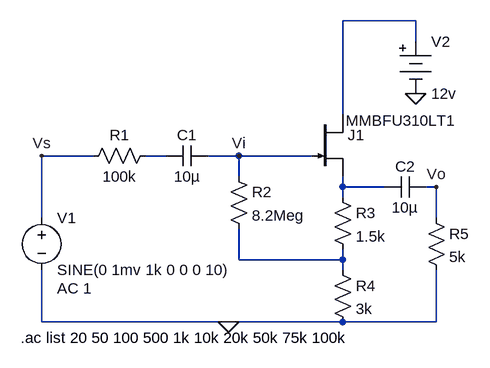
[diagram p0: schematic BootstrapV2.asc]
BootstrapV2.asc, the LTspice schematic file:
Version 4
SHEET 1 952 680
WIRE 512 -48 400 -48
WIRE 512 -16 512 -48
WIRE 400 96 400 -48
WIRE 16 160 -64 160
WIRE 128 160 96 160
WIRE 240 160 192 160
WIRE 352 160 240 160
WIRE 240 192 240 160
WIRE 400 208 400 192
WIRE 464 208 400 208
WIRE 544 208 528 208
WIRE 400 224 400 208
WIRE -64 256 -64 160
WIRE 544 256 544 208
WIRE 240 320 240 272
WIRE 400 320 400 304
WIRE 400 320 240 320
WIRE 400 336 400 320
WIRE -64 416 -64 336
WIRE 224 416 -64 416
WIRE 400 416 224 416
WIRE 544 416 544 336
WIRE 544 416 400 416
FLAG 224 416 0
FLAG 512 64 0
FLAG 544 208 Vo
FLAG 240 160 Vi
FLAG -64 160 Vs
SYMBOL res 112 144 R90
WINDOW 0 0 56 VBottom 2
WINDOW 3 32 56 VTop 2
SYMATTR InstName R1
SYMATTR Value 100k
SYMATTR SpiceLine tol=5
SYMBOL cap 192 144 R90
WINDOW 0 0 32 VBottom 2
WINDOW 3 32 32 VTop 2
SYMATTR InstName C1
SYMATTR Value 10µ
SYMBOL res 224 176 R0
SYMATTR InstName R2
SYMATTR Value 8.2Meg
SYMATTR SpiceLine tol=10
SYMBOL res 384 208 R0
SYMATTR InstName R3
SYMATTR Value 1.5k
SYMATTR SpiceLine tol=5
SYMBOL res 384 320 R0
SYMATTR InstName R4
SYMATTR Value 3k
SYMATTR SpiceLine tol=10
SYMBOL res 528 240 R0
SYMATTR InstName R5
SYMATTR Value 5k
SYMATTR SpiceLine tol=5
SYMBOL cap 528 192 R90
WINDOW 0 0 32 VBottom 2
WINDOW 3 32 32 VTop 2
SYMATTR InstName C2
SYMATTR Value 10µ
SYMBOL njf 352 96 R0
WINDOW 3 53 10 Left 2
SYMATTR Value MMBFU310LT1
SYMATTR InstName J1
SYMBOL voltage -64 240 R0
WINDOW 123 24 124 Left 2
WINDOW 39 0 0 Left 0
SYMATTR Value2 AC 1
SYMATTR InstName V1
SYMATTR Value SINE(0 1mv 1k 0 0 0 10)
SYMBOL Misc\\battery 512 -32 R0
WINDOW 123 0 0 Left 0
WINDOW 39 0 0 Left 0
SYMATTR InstName V2
SYMATTR Value 12v
TEXT -96 440 Left 2 !.ac list 20 50 100 500 1k 10k 20k 50k 75k 100k

The netlist it stands for:
* BootstrapV2.asc
R1 N002 Vs 100k tol=5
C1 Vi N002 10µ
R2 Vi N004 8.2Meg tol=10
R3 N003 N004 1.5k tol=5
R4 N004 0 3k tol=10
R5 Vo 0 5k tol=5
C2 Vo N003 10µ
J1 N001 Vi N003 MMBFU310LT1
V1 Vs 0 SINE(0 1mv 1k 0 0 0 10) AC 1
V2 N001 0 12v
.model NJF NJF
.model PJF PJF
.lib standard.jft
.ac list 20 50 100 500 1k 10k 20k 50k 75k 100k
.backanno
.end